# Altium schematic sheet Snip_Power.SchDoc
size A
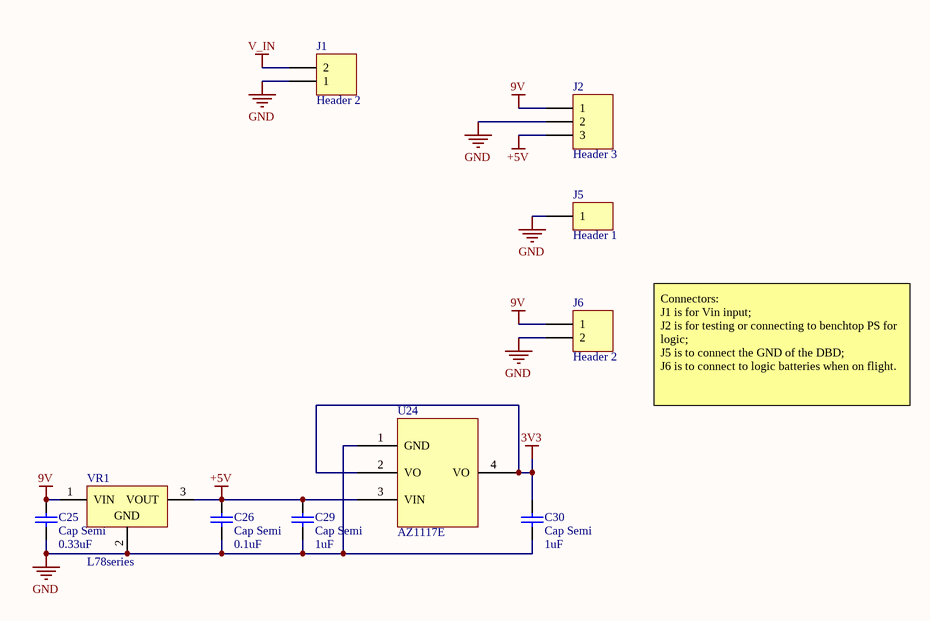
[diagram p0: Snip_Power.SchDoc]

## Parts
C25  Cap Semi  value 0.33uF  [C1206]
C26  Cap Semi  value 0.1uF  [C1206]
C29  Cap Semi  value 1uF  [C1206]
C30  Cap Semi  value 1uF  [C1206]
J1  Header 2  [PheonixContact_1757242]
J2  Header 3  [3_test_pin]
J5  Header 1  [GNDOUT]
J6  Header 2  [BatteryConnector_Molex_1720640002]
U24  AZ1117E  [SOT223]
VR1  L78series  [L78_TO220_3]

## Nets
3V3: C30.2 U24.2(VO) U24.4(VO)
9V: C25.2 J2.1 J6.1 VR1.1(VIN)
+5V: C26.2 C29.2 J2.3 U24.3(VIN) VR1.3(VOUT)
GND: C25.1 C26.1 C29.1 C30.1 J1.1 J2.2 J5.1 J6.2 U24.1(GND) VR1.2(GND)
V_IN: J1.2

## Notes on the sheet
- Connectors:
  J1 is for Vin input;
  J2 is for testing or connecting to benchtop PS for logic;
  J5 is to connect the GND of the DBD;
  J6 is to connect to logic batteries when on flight.

## Library data of the parts
C25 C26 C29 C30 = Cap Semi: Capacitor (Semiconductor SIM Model); Published: 8-Jun-2000; LatestRevisionDate: 29-May-2009; LatestRevisionNote: IPC-7351 Footprint Added.; PackageReference: C1206; Publisher: Altium Limited; PackageDescription: Chip Capacitor
J1 J6 = Header 2: Header, 2-Pin; LatestRevisionDate: 17-Jul-2002; LatestRevisionNote: Re-released for DXP Platform.; Publisher: Altium Limited
J2 = Header 3: Header, 3-Pin; LatestRevisionDate: 17-Jul-2002; LatestRevisionNote: Re-released for DXP Platform.; Publisher: Altium Limited
J5 = Header 1: Header, 1-Pin; LatestRevisionDate: 17-Jul-2002; LatestRevisionNote: Re-released for DXP Platform.; Publisher: Altium Limited
VR1 = PM-REG-L78: Positive Voltage Regulator; ComponentLink1Description: Manufacturer URL; PackageVersion: 2011; ComponentLink1URL: http://www.st.com; DatasheetVersion: 1/02/2011